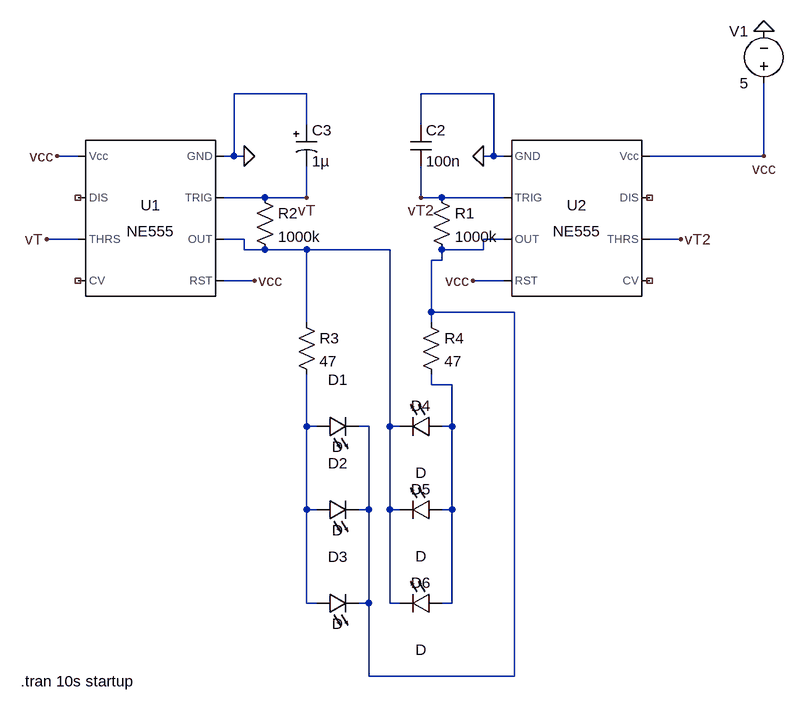
[diagram p0: schematic Project_police_light_flashing_effect.asc]
Project_police_light_flashing_effect.asc, the LTspice schematic file:
Version 4.1
SHEET 1 1032 924
WIRE 288 0 176 0
WIRE 576 0 464 0
WIRE 288 48 288 0
WIRE 464 48 464 0
WIRE -64 96 -96 96
WIRE 176 96 176 0
WIRE 176 96 160 96
WIRE 192 96 176 96
WIRE 576 96 576 0
WIRE 576 96 560 96
WIRE 592 96 576 96
WIRE 992 96 992 -16
WIRE 992 96 816 96
WIRE 224 160 160 160
WIRE 288 160 288 112
WIRE 288 160 224 160
WIRE 464 160 464 112
WIRE 496 160 464 160
WIRE 592 160 496 160
WIRE -64 224 -112 224
WIRE 192 224 160 224
WIRE 592 224 560 224
WIRE 864 224 816 224
WIRE 192 240 192 224
WIRE 224 240 192 240
WIRE 288 240 224 240
WIRE 416 240 288 240
WIRE 560 240 560 224
WIRE 560 240 496 240
WIRE 496 256 496 240
WIRE 496 256 480 256
WIRE 208 288 160 288
WIRE 592 288 544 288
WIRE 480 336 480 256
WIRE 608 336 480 336
WIRE 288 352 288 240
WIRE 480 352 480 336
WIRE 480 448 480 432
WIRE 512 448 480 448
WIRE 288 512 288 432
WIRE 304 512 288 512
WIRE 384 512 368 512
WIRE 416 512 416 240
WIRE 432 512 416 512
WIRE 512 512 512 448
WIRE 512 512 496 512
WIRE 288 640 288 512
WIRE 304 640 288 640
WIRE 384 640 384 512
WIRE 384 640 368 640
WIRE 416 640 416 512
WIRE 432 640 416 640
WIRE 512 640 512 512
WIRE 512 640 496 640
WIRE 288 784 288 640
WIRE 304 784 288 784
WIRE 384 784 384 640
WIRE 384 784 368 784
WIRE 416 784 416 640
WIRE 432 784 416 784
WIRE 512 784 512 640
WIRE 512 784 496 784
WIRE 384 896 384 784
WIRE 608 896 608 336
WIRE 608 896 384 896
FLAG 992 96 vcc
FLAG -96 96 vcc
FLAG 208 288 vcc
FLAG 544 288 vcc
FLAG 560 96 0
FLAG 192 96 0
FLAG 288 160 vT
FLAG -112 224 vT
FLAG 464 160 vT2
FLAG 864 224 vT2
FLAG 992 -96 0
SYMBOL Misc\\NE555 48 192 M0
SYMATTR InstName U1
SYMBOL Misc\\NE555 704 192 R0
SYMATTR InstName U2
SYMBOL voltage 992 0 R180
WINDOW 0 24 96 Left 2
WINDOW 3 24 16 Left 2
WINDOW 123 0 0 Left 0
WINDOW 39 0 0 Left 0
SYMATTR InstName V1
SYMATTR Value 5
SYMBOL cap 448 48 R0
SYMATTR InstName C2
SYMATTR Value 100n
SYMBOL res 480 144 R0
SYMATTR InstName R1
SYMATTR Value 1000k
SYMBOL res 208 144 R0
SYMATTR InstName R2
SYMATTR Value 1000k
SYMBOL res 272 336 R0
SYMATTR InstName R3
SYMATTR Value 47
SYMBOL res 464 336 R0
SYMATTR InstName R4
SYMATTR Value 47
SYMBOL LED 304 528 R270
WINDOW 0 72 32 VTop 2
WINDOW 3 0 32 VBottom 2
SYMATTR InstName D1
SYMBOL LED 304 656 R270
WINDOW 0 72 32 VTop 2
WINDOW 3 0 32 VBottom 2
SYMATTR InstName D2
SYMBOL LED 304 800 R270
WINDOW 0 72 32 VTop 2
WINDOW 3 0 32 VBottom 2
SYMATTR InstName D3
SYMBOL LED 496 496 R90
WINDOW 0 0 32 VBottom 2
WINDOW 3 72 32 VTop 2
SYMATTR InstName D4
SYMBOL LED 496 624 R90
WINDOW 0 0 32 VBottom 2
WINDOW 3 72 32 VTop 2
SYMATTR InstName D5
SYMBOL LED 496 768 R90
WINDOW 0 0 32 VBottom 2
WINDOW 3 72 32 VTop 2
SYMATTR InstName D6
SYMBOL polcap 272 48 R0
SYMATTR InstName C3
SYMATTR Value 1µ
TEXT -152 904 Left 2 !.tran 10s startup

The netlist it stands for:
* Project_police_light_flashing_effect.asc
X§U1 0 vT N001 vcc NC_01 vT NC_02 vcc NE555  ; pins GND TRIG OUT RST CV THRS DIS Vcc
X§U2 0 vT2 N002 vcc NC_03 vT2 NC_04 vcc NE555  ; pins GND TRIG OUT RST CV THRS DIS Vcc
V1 vcc 0 5
C2 0 vT2 100n
R1 vT2 N002 1000k
R2 vT N001 1000k
R3 N001 N004 47
R4 N002 N003 47
D1 N004 N002 D
D2 N004 N002 D
D3 N004 N002 D
D4 N003 N001 D
D5 N003 N001 D
D6 N003 N001 D
C3 0 vT 1µ
.model D D
.lib standard.dio
.tran 10s startup
.lib NE555.sub
.backanno
.end

* Results of the author's LTspice run, read from the files saved beside the schematic
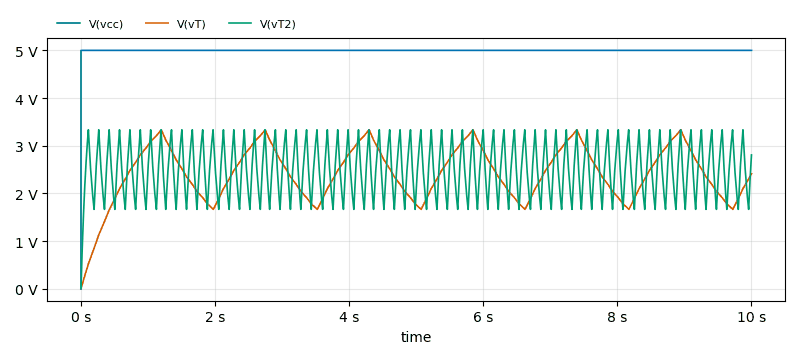
[diagram p1: Transient Analysis of Project_police_light_flashing_effect.asc, plotted from the saved traces]
* Transient Analysis, 1 run:
*   V(vcc): min 0 V, max 5 V, average 5 V, rms 5 V, last 5 V
*   V(vT): min 0 V, max 3.334 V, average 2.412 V, rms 2.482 V, last 2.412 V
*   V(vT2): min 0 V, max 3.334 V, average 2.49 V, rms 2.555 V, last 2.808 V